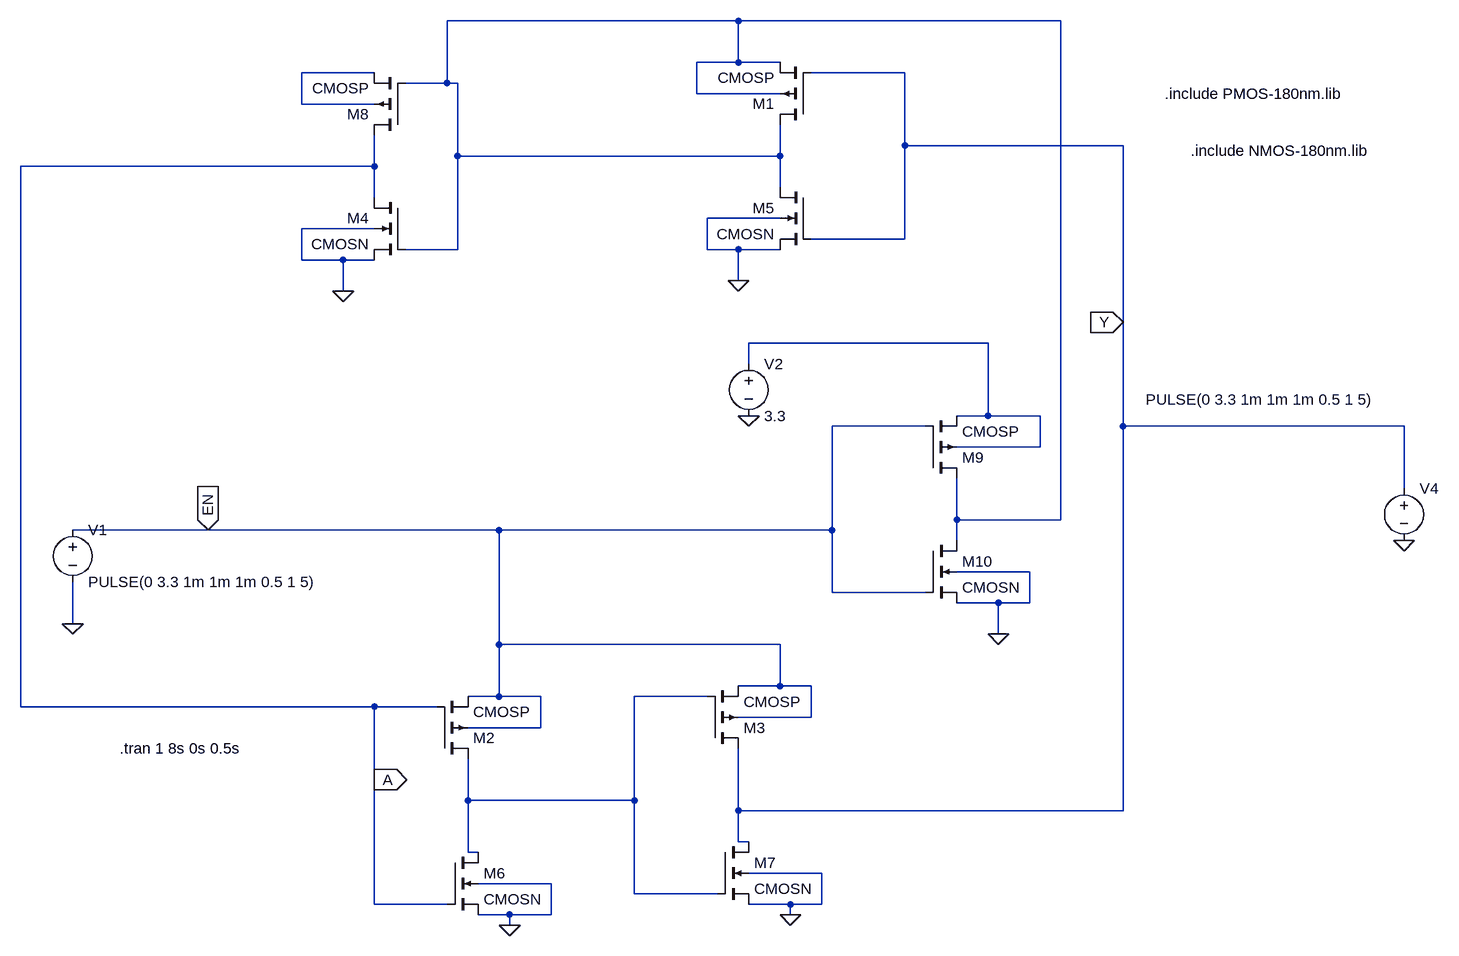
[diagram p0: schematic portBtoA.asc]
portBtoA.asc, the LTspice schematic file:
Version 4
SHEET 1 1368 980
WIRE 288 -432 -160 -432
WIRE 784 -432 288 -432
WIRE 288 -368 288 -432
WIRE 288 -368 224 -368
WIRE 352 -368 288 -368
WIRE -272 -352 -384 -352
WIRE 544 -352 400 -352
WIRE -160 -336 -160 -432
WIRE -160 -336 -224 -336
WIRE -144 -336 -160 -336
WIRE 224 -320 224 -368
WIRE 352 -320 224 -320
WIRE -384 -304 -384 -352
WIRE -272 -304 -384 -304
WIRE 544 -240 544 -352
WIRE 880 -240 544 -240
WIRE -144 -224 -144 -336
WIRE 352 -224 352 -272
WIRE 352 -224 -144 -224
WIRE -272 -208 -272 -256
WIRE -272 -208 -816 -208
WIRE 352 -176 352 -224
WIRE -272 -160 -272 -208
WIRE 352 -128 240 -128
WIRE -272 -112 -384 -112
WIRE 544 -96 544 -240
WIRE 544 -96 400 -96
WIRE -144 -80 -144 -224
WIRE -144 -80 -224 -80
WIRE 240 -80 240 -128
WIRE 288 -80 240 -80
WIRE 352 -80 288 -80
WIRE -384 -64 -384 -112
WIRE -320 -64 -384 -64
WIRE -272 -64 -320 -64
WIRE 288 -32 288 -80
WIRE -320 -16 -320 -64
WIRE 880 32 880 -240
WIRE 672 64 304 64
WIRE 304 96 304 64
WIRE 672 176 672 64
WIRE 672 176 624 176
WIRE 752 176 672 176
WIRE 576 192 432 192
WIRE 880 192 880 32
WIRE 1312 192 880 192
WIRE 752 224 752 176
WIRE 752 224 624 224
WIRE 1312 288 1312 192
WIRE 624 336 624 272
WIRE 784 336 784 -432
WIRE 784 336 624 336
WIRE -528 352 -736 352
WIRE -80 352 -528 352
WIRE 432 352 432 192
WIRE 432 352 -80 352
WIRE 624 368 624 336
WIRE 736 416 624 416
WIRE 432 448 432 352
WIRE 576 448 432 448
WIRE 688 464 624 464
WIRE 736 464 736 416
WIRE 736 464 688 464
WIRE -736 496 -736 432
WIRE 688 512 688 464
WIRE -80 528 -80 352
WIRE 352 528 -80 528
WIRE 352 592 352 528
WIRE 352 592 288 592
WIRE 400 592 352 592
WIRE -80 608 -80 528
WIRE -80 608 -128 608
WIRE -16 608 -80 608
WIRE 240 608 128 608
WIRE -816 624 -816 -208
WIRE -272 624 -816 624
WIRE -176 624 -272 624
WIRE 400 640 400 592
WIRE 400 640 288 640
WIRE -16 656 -16 608
WIRE -16 656 -128 656
WIRE -272 736 -272 624
WIRE -128 768 -128 704
WIRE 128 768 128 608
WIRE 128 768 -128 768
WIRE 288 784 288 688
WIRE 880 784 880 192
WIRE 880 784 288 784
WIRE 288 832 288 784
WIRE 304 832 288 832
WIRE -128 848 -128 768
WIRE -112 848 -128 848
WIRE 416 880 304 880
WIRE 0 896 -112 896
WIRE 128 912 128 768
WIRE 256 912 128 912
WIRE -272 928 -272 736
WIRE -160 928 -272 928
WIRE 368 928 304 928
WIRE 416 928 416 880
WIRE 416 928 368 928
WIRE -64 944 -112 944
WIRE 0 944 0 896
WIRE 0 944 -64 944
WIRE 368 944 368 928
WIRE -64 960 -64 944
FLAG -320 -16 0
FLAG 288 -32 0
FLAG -736 496 0
FLAG 880 32 Y
IOPIN 880 32 In
FLAG -528 352 EN
IOPIN -528 352 In
FLAG -64 960 0
FLAG 368 944 0
FLAG -272 736 A
IOPIN -272 736 Out
FLAG 688 512 0
FLAG 304 176 0
FLAG 1312 368 0
SYMBOL voltage -736 336 R0
WINDOW 123 0 0 Left 0
WINDOW 39 0 0 Left 0
SYMATTR InstName V1
SYMATTR Value PULSE(0 3.3 1m 1m 1m 0.5 1 5)
SYMBOL pmos4 400 -272 R180
SYMATTR InstName M1
SYMATTR Value CMOSP
SYMATTR Value2 l=180n w=900n m=1
SYMBOL pmos4 -176 704 M180
SYMATTR InstName M2
SYMATTR Value CMOSP
SYMATTR Value2 l=180n w=900n m=1
SYMBOL pmos4 240 688 M180
SYMATTR InstName M3
SYMATTR Value CMOSP
SYMATTR Value2 l=180n w=900n m=1
SYMBOL nmos4 -224 -160 M0
SYMATTR InstName M4
SYMATTR Value CMOSN
SYMATTR Value2 l=180n w=360n
SYMBOL nmos4 400 -176 M0
SYMATTR InstName M5
SYMATTR Value CMOSN
SYMATTR Value2 l=180n w=360n
SYMBOL nmos4 -160 848 R0
SYMATTR InstName M6
SYMATTR Value CMOSN
SYMATTR Value2 l=180n w=360n
SYMBOL nmos4 256 832 R0
SYMATTR InstName M7
SYMATTR Value CMOSN
SYMATTR Value2 l=180n w=360n
SYMBOL pmos4 -224 -256 R180
SYMATTR InstName M8
SYMATTR Value CMOSP
SYMATTR Value2 l=180n w=900n m=1
SYMBOL pmos4 576 272 M180
SYMATTR InstName M9
SYMATTR Value CMOSP
SYMATTR Value2 l=180n w=900n m=1
SYMBOL nmos4 576 368 R0
SYMATTR InstName M10
SYMATTR Value CMOSN
SYMATTR Value2 l=180n w=360n
SYMBOL voltage 304 80 R0
WINDOW 123 0 0 Left 0
WINDOW 39 0 0 Left 0
SYMATTR InstName V2
SYMATTR Value 3.3
SYMBOL voltage 1312 272 R0
WINDOW 123 0 0 Left 0
WINDOW 39 0 0 Left 0
WINDOW 3 -397 -121 Left 2
SYMATTR Value PULSE(0 3.3 1m 1m 1m 0.5 1 5)
SYMATTR InstName V4
TEXT 944 -320 Left 2 !.include PMOS-180nm.lib
TEXT 984 -232 Left 2 !.include NMOS-180nm.lib
TEXT -664 688 Left 2 !.tran 1 8s 0s 0.5s

The netlist it stands for:
* portBtoA.asc
V1 EN 0 PULSE(0 3.3 1m 1m 1m 0.5 1 5)
M1 N001 Y N001 N001 CMOSP l=180n w=900n m=1
M2 N004 A EN EN CMOSP l=180n w=900n m=1
M3 Y N004 EN EN CMOSP l=180n w=900n m=1
M4 A N001 0 0 CMOSN l=180n w=360n
M5 N001 Y 0 0 CMOSN l=180n w=360n
M6 N004 A 0 0 CMOSN l=180n w=360n
M7 Y N004 0 0 CMOSN l=180n w=360n
M8 A N001 N002 N002 CMOSP l=180n w=900n m=1
M9 N001 EN N003 N003 CMOSP l=180n w=900n m=1
M10 N001 EN 0 0 CMOSN l=180n w=360n
V2 N003 0 3.3
V4 Y 0 PULSE(0 3.3 1m 1m 1m 0.5 1 5)
.model NMOS NMOS
.model PMOS PMOS
.lib standard.mos
.include PMOS-180nm.lib
.include NMOS-180nm.lib
.tran 1 8s 0s 0.5s
.backanno
.end